# Altium schematic sheet P8_AudioOutput.SchDoc
size A
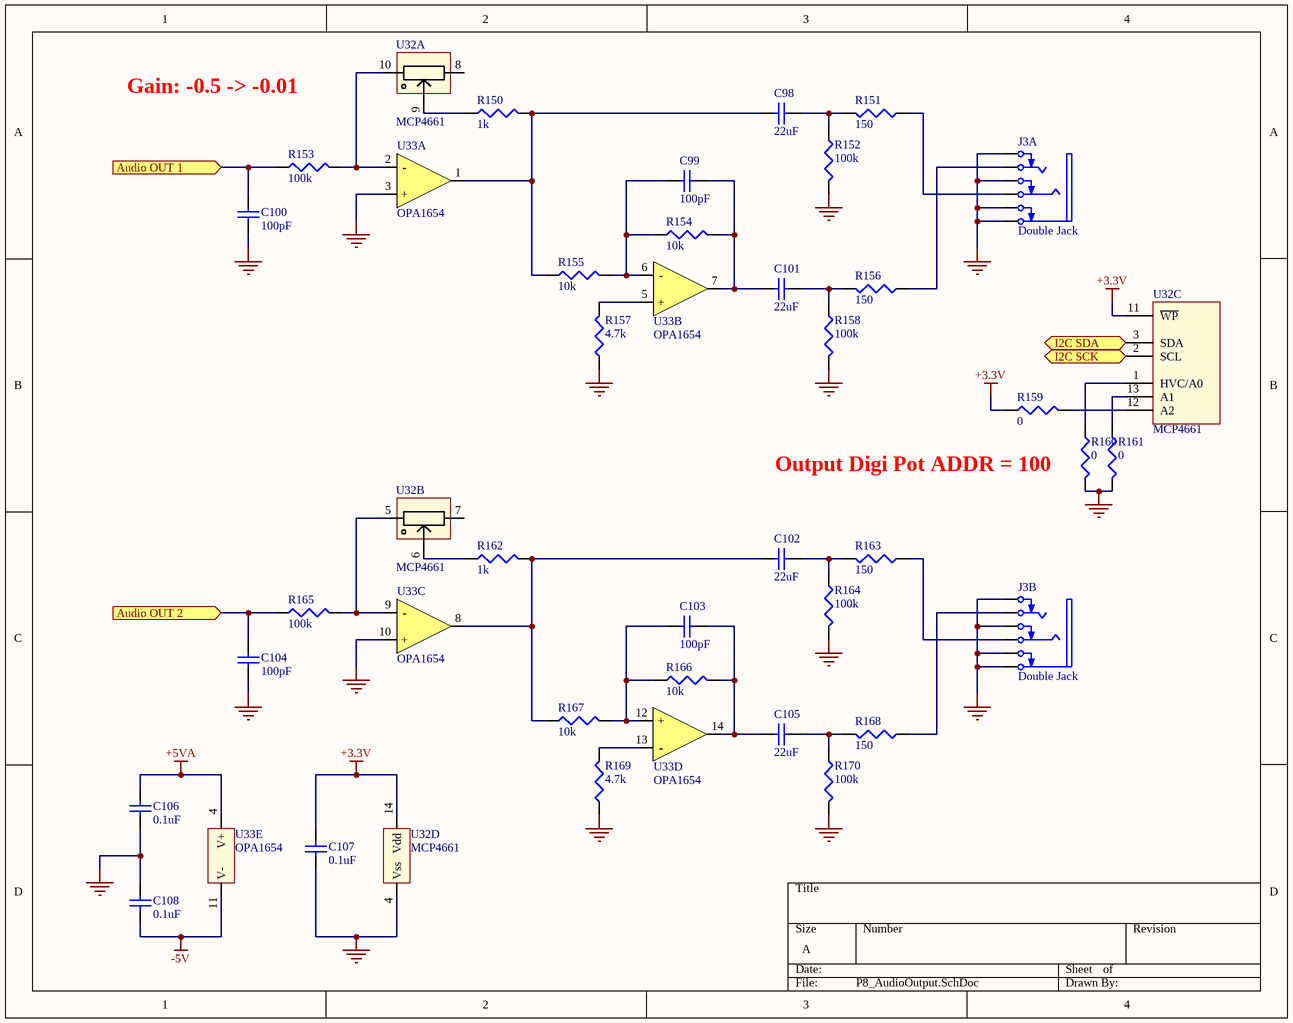
[diagram p0: P8_AudioOutput.SchDoc]

## Parts
C98  22uF  [CAP 0603 (1608 metric)]
C99  100pF  [CAP 0603 (1608 metric)]
C100  100pF  [CAP 0603 (1608 metric)]
C101  22uF  [CAP 0603 (1608 metric)]
C102  22uF  [CAP 0603 (1608 metric)]
C103  100pF  [CAP 0603 (1608 metric)]
C104  100pF  [CAP 0603 (1608 metric)]
C105  22uF  [CAP 0603 (1608 metric)]
C106  0.1uF  [CAP 0603 (1608 metric)]
C107  0.1uF  [CAP 0603 (1608 metric)]
C108  0.1uF  [CAP 0603 (1608 metric)]
J3  Double Jack  (parts A,B of 2)
R150  1k  [RES 0603 (1608 metric)]
R151  150  [RES 0603 (1608 metric)]
R152  100k  [RES 0603 (1608 metric)]
R153  100k  [RES 0603 (1608 metric)]
R154  10k  [RES 0603 (1608 metric)]
R155  10k  [RES 0603 (1608 metric)]
R156  150  [RES 0603 (1608 metric)]
R157  4.7k  [RES 0603 (1608 metric)]
R158  100k  [RES 0603 (1608 metric)]
R159  0  [RES 0603 (1608 metric)]
R160  0  [RES 0603 (1608 metric)]
R161  0  [RES 0603 (1608 metric)]
R162  1k  [RES 0603 (1608 metric)]
R163  150  [RES 0603 (1608 metric)]
R164  100k  [RES 0603 (1608 metric)]
R165  100k  [RES 0603 (1608 metric)]
R166  10k  [RES 0603 (1608 metric)]
R167  10k  [RES 0603 (1608 metric)]
R168  150  [RES 0603 (1608 metric)]
R169  4.7k  [RES 0603 (1608 metric)]
R170  100k  [RES 0603 (1608 metric)]
U32  MCP4661  (parts A,B,C,D of 4)
U33  OPA1654  (parts A,B,C,D,E of 5)

## Ports
Audio OUT 1 (in), Audio OUT 2 (in), I2C SCK, I2C SDA

## Nets
+3.3V: C107.1 R159.1 U32.11(~{WP}) U32.14(Vdd)
+5VA: C106.1 U33.4(V+)
-5V: C108.2 U33.11(V-)
GND: C100.1 C104.1 C106.2 C107.2 C108.1 J3.1(SB) J3.2(RB) J3.3(TB) J3.4(S) J3.7(SB) J3.8(RB) J3.9(TB) J3.10(S) R152.2 R157.1 R158.2 R160.2 R161.2 R164.2 R169.1 R170.2 U32.4(Vss) U33.3(+) U33.10(+)
Audio OUT 1: C100.2 R153.1 ; port Audio OUT 1
Audio OUT 2: C104.2 R165.1 ; port Audio OUT 2
I2C SCK: U32.2(SCL) ; port I2C SCK
I2C SDA: U32.3(SDA) ; port I2C SDA
NetC98_1: C98.1 R151.2 R152.1
NetC98_2: C98.2 R150.2 R155.1 U33.1(OUT)
NetC99_1: C99.1 C101.2 R154.2 U33.7(OUT)
NetC99_2: C99.2 R154.1 R155.2 U33.6(-)
NetC101_1: C101.1 R156.2 R158.1
NetC102_1: C102.1 R163.2 R164.1
NetC102_2: C102.2 R162.2 R167.1 U33.8(OUT)
NetC103_1: C103.1 C105.2 R166.2 U33.14(OUT)
NetC103_2: C103.2 R166.1 R167.2 U33.12(+)
NetC105_1: C105.1 R168.2 R170.1
NetJ3_5: J3.5(R) R163.1
NetJ3_6: J3.6(T) R168.1
NetJ3_11: J3.11(R) R151.1
NetJ3_12: J3.12(T) R156.1
NetR150_1: R150.1 U32.9(P0W)
NetR153_2: R153.2 U32.10(P0B) U33.2(-)
NetR157_2: R157.2 U33.5(+)
NetR159_2: R159.2 U32.12(A2)
NetR160_1: R160.1 U32.1(HVC/A0)
NetR161_1: R161.1 U32.13(A1)
NetR162_1: R162.1 U32.6(P1W)
NetR165_2: R165.2 U32.5(P1B) U33.9(-)
NetR169_2: R169.2 U33.13(-)

Not connected (* = marked no-connect by the designer): U32 7(P1A) 8(P0A)

## Notes on the sheet
- Gain: -0.5 -> -0.01
- Output Digi Pot ADDR = 100

## Library data of the parts
C98-C108 = Cap Semi: Capacitor (Semiconductor SIM Model)
  C98 C101 C102 C105: Value: 22uF
  C99 C100 C103 C104: Value: 100pF
  C106-C108: Value: 0.1uF
J3 = Dual TRS Jack Bypassed: Dual Jack stereo bypassed
R150-R170 = Res3: Resistor
  R150 R162: Value: 1k
  R151 R156 R163 R168: Value: 150
  R152 R153 R158 R164 R165 R170: Value: 100k
  R154 R155 R166 R167: Value: 10k
  R157 R169: Value: 4.7k
  R159-R161: Value: 0
U32 = MCP4661: Dual DigiPot non volatile I2C
U33 = OPA1654: Quad Audio OpAmp